# EAGLE design Board (EAGLE 9.2.2)
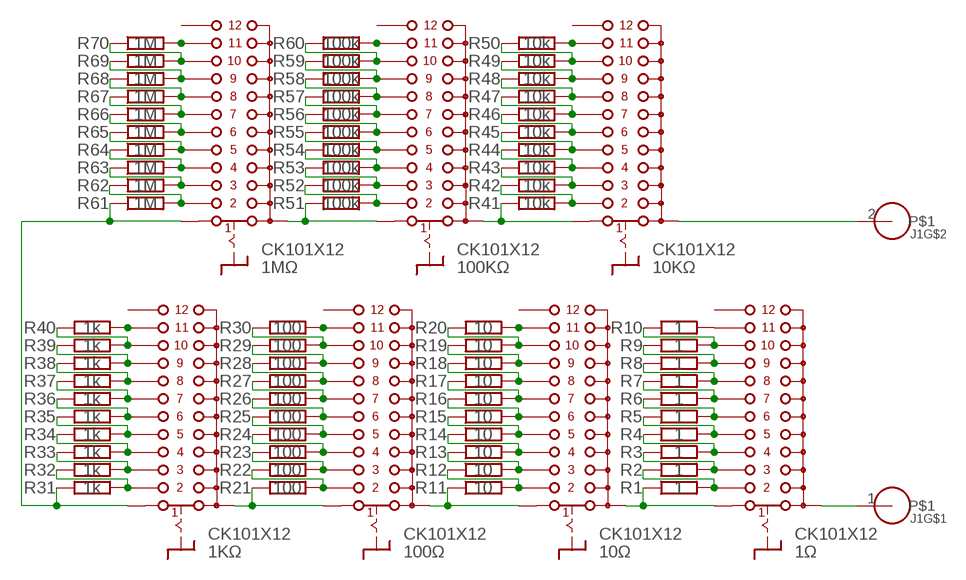
[diagram p0: schematic, sheet 1]

## Parts
1KΩ  CK101X12  [CK101X12]
1MΩ  CK101X12  [CK101X12]
1Ω  CK101X12  [CK101X12]
10KΩ  CK101X12  [CK101X12]
10Ω  CK101X12  [CK101X12]
100KΩ  CK101X12  [CK101X12]
100Ω  CK101X12  [CK101X12]
J1  MOLEX-1X2  [MOLEX-1X2_LOCK]
R1  1  R-EU  [0207/2V]
R2  1  R-EU  [0207/2V]
R3  1  R-EU  [0207/2V]
R4  1  R-EU  [0207/2V]
R5  1  R-EU  [0207/2V]
R6  1  R-EU  [0207/2V]
R7  1  R-EU  [0207/2V]
R8  1  R-EU  [0207/2V]
R9  1  R-EU  [0207/2V]
R10  1  R-EU  [0207/2V]
R11  10  R-EU  [0207/2V]
R12  10  R-EU  [0207/2V]
R13  10  R-EU  [0207/2V]
R14  10  R-EU  [0207/2V]
R15  10  R-EU  [0207/2V]
R16  10  R-EU  [0207/2V]
R17  10  R-EU  [0207/2V]
R18  10  R-EU  [0207/2V]
R19  10  R-EU  [0207/2V]
R20  10  R-EU  [0207/2V]
R21  100  R-EU  [0207/2V]
R22  100  R-EU  [0207/2V]
R23  100  R-EU  [0207/2V]
R24  100  R-EU  [0207/2V]
R25  100  R-EU  [0207/2V]
R26  100  R-EU  [0207/2V]
R27  100  R-EU  [0207/2V]
R28  100  R-EU  [0207/2V]
R29  100  R-EU  [0207/2V]
R30  100  R-EU  [0207/2V]
R31  1k  R-EU  [0207/2V]
R32  1k  R-EU  [0207/2V]
R33  1k  R-EU  [0207/2V]
R34  1k  R-EU  [0207/2V]
R35  1k  R-EU  [0207/2V]
R36  1k  R-EU  [0207/2V]
R37  1k  R-EU  [0207/2V]
R38  1k  R-EU  [0207/2V]
R39  1k  R-EU  [0207/2V]
R40  1k  R-EU  [0207/2V]
R41  10k  R-EU  [0207/2V]
R42  10k  R-EU  [0207/2V]
R43  10k  R-EU  [0207/2V]
R44  10k  R-EU  [0207/2V]
R45  10k  R-EU  [0207/2V]
R46  10k  R-EU  [0207/2V]
R47  10k  R-EU  [0207/2V]
R48  10k  R-EU  [0207/2V]
R49  10k  R-EU  [0207/2V]
R50  10k  R-EU  [0207/2V]
R51  100k  R-EU  [0207/2V]
R52  100k  R-EU  [0207/2V]
R53  100k  R-EU  [0207/2V]
R54  100k  R-EU  [0207/2V]
R55  100k  R-EU  [0207/2V]
R56  100k  R-EU  [0207/2V]
R57  100k  R-EU  [0207/2V]
R58  100k  R-EU  [0207/2V]
R59  100k  R-EU  [0207/2V]
R60  100k  R-EU  [0207/2V]
R61  1M  R-EU  [0207/2V]
R62  1M  R-EU  [0207/2V]
R63  1M  R-EU  [0207/2V]
R64  1M  R-EU  [0207/2V]
R65  1M  R-EU  [0207/2V]
R66  1M  R-EU  [0207/2V]
R67  1M  R-EU  [0207/2V]
R68  1M  R-EU  [0207/2V]
R69  1M  R-EU  [0207/2V]
R70  1M  R-EU  [0207/2V]

## Nets
N$1: 1Ω.2 R1.2 R2.1
N$2: 10Ω.2 R11.2 R12.1
N$3: 10Ω.1 100Ω.A R11.1
N$4: 10Ω.3 R12.2 R13.1
N$5: 10Ω.4 R13.2 R14.1
N$6: 10Ω.5 R14.2 R15.1
N$7: 10Ω.6 R15.2 R16.1
N$8: 10Ω.7 R16.2 R17.1
N$9: 10Ω.8 R17.2 R18.1
N$10: 10Ω.9 R18.2 R19.1
N$11: 1KΩ.10 R39.2 R40.1
N$12: 1Ω.3 R2.2 R3.1
N$13: 1Ω.4 R3.2 R4.1
N$14: 1Ω.5 R4.2 R5.1
N$15: 1Ω.6 R5.2 R6.1
N$16: 10Ω.10 R19.2 R20.1
N$17: 1Ω.7 R6.2 R7.1
N$18: 1Ω.8 R7.2 R8.1
N$19: 1Ω.9 R8.2 R9.1
N$20: 1Ω.10 R9.2 R10.1
N$21: 1Ω.11 R10.2
N$22: 10Ω.11 R20.2
N$23: 100Ω.2 R21.2 R22.1
N$24: 10KΩ.1 100KΩ.A R41.1
N$25: 100Ω.3 R22.2 R23.1
N$26: 100Ω.4 R23.2 R24.1
N$27: 100Ω.5 R24.2 R25.1
N$28: 100Ω.6 R25.2 R26.1
N$29: 100Ω.7 R26.2 R27.1
N$30: 100Ω.8 R27.2 R28.1
N$31: 100Ω.9 R28.2 R29.1
N$32: 100Ω.10 R29.2 R30.1
N$33: 100Ω.11 R30.2
N$34: 1KΩ.2 R31.2 R32.1
N$35: 1Ω.1 10Ω.A R1.1
N$36: 1KΩ.3 R32.2 R33.1
N$37: 1KΩ.4 R33.2 R34.1
N$38: 1KΩ.5 R34.2 R35.1
N$39: 1KΩ.6 R35.2 R36.1
N$40: 1KΩ.7 R36.2 R37.1
N$41: 1KΩ.8 R37.2 R38.1
N$42: 1KΩ.9 R38.2 R39.1
N$43: 1KΩ.1 1MΩ.1 R31.1 R61.1
N$44: 1KΩ.11 R40.2
N$45: 10KΩ.2 R41.2 R42.1
N$46: 10KΩ.A J1.2
N$47: 10KΩ.3 R42.2 R43.1
N$48: 10KΩ.4 R43.2 R44.1
N$49: 10KΩ.5 R44.2 R45.1
N$50: 10KΩ.6 R45.2 R46.1
N$51: 10KΩ.7 R46.2 R47.1
N$52: 10KΩ.8 R47.2 R48.1
N$53: 10KΩ.9 R48.2 R49.1
N$54: 10KΩ.10 R49.2 R50.1
N$55: 10KΩ.11 R50.2
N$56: 100KΩ.2 R51.2 R52.1
N$57: 1MΩ.A 100KΩ.1 R51.1
N$58: 100KΩ.3 R52.2 R53.1
N$59: 100KΩ.4 R53.2 R54.1
N$60: 100KΩ.5 R54.2 R55.1
N$61: 100KΩ.6 R55.2 R56.1
N$62: 100KΩ.7 R56.2 R57.1
N$63: 100KΩ.8 R57.2 R58.1
N$64: 100KΩ.9 R58.2 R59.1
N$65: 100KΩ.10 R59.2 R60.1
N$66: 100KΩ.11 R60.2
N$67: 1MΩ.2 R61.2 R62.1
N$68: 1KΩ.A 100Ω.1 R21.1
N$69: 1MΩ.3 R62.2 R63.1
N$70: 1MΩ.4 R63.2 R64.1
N$71: 1MΩ.5 R64.2 R65.1
N$72: 1MΩ.6 R65.2 R66.1
N$73: 1MΩ.7 R66.2 R67.1
N$74: 1MΩ.8 R67.2 R68.1
N$75: 1MΩ.9 R68.2 R69.1
N$76: 1MΩ.10 R69.2 R70.1
N$77: 1MΩ.11 R70.2
N$81: 1Ω.A J1.1
Unconnected: 1KΩ.12 1MΩ.12 1Ω.12 10KΩ.12 10Ω.12 100KΩ.12 100Ω.12

## Library data of the parts
1KΩ 1MΩ 1Ω 10KΩ 10Ω 100KΩ 100Ω = DecadeResistanceBox:CK101X12
J1 = DecadeResistanceBox:MOLEX-1X2
R1-R70 = DecadeResistanceBox:R-EU

## Board
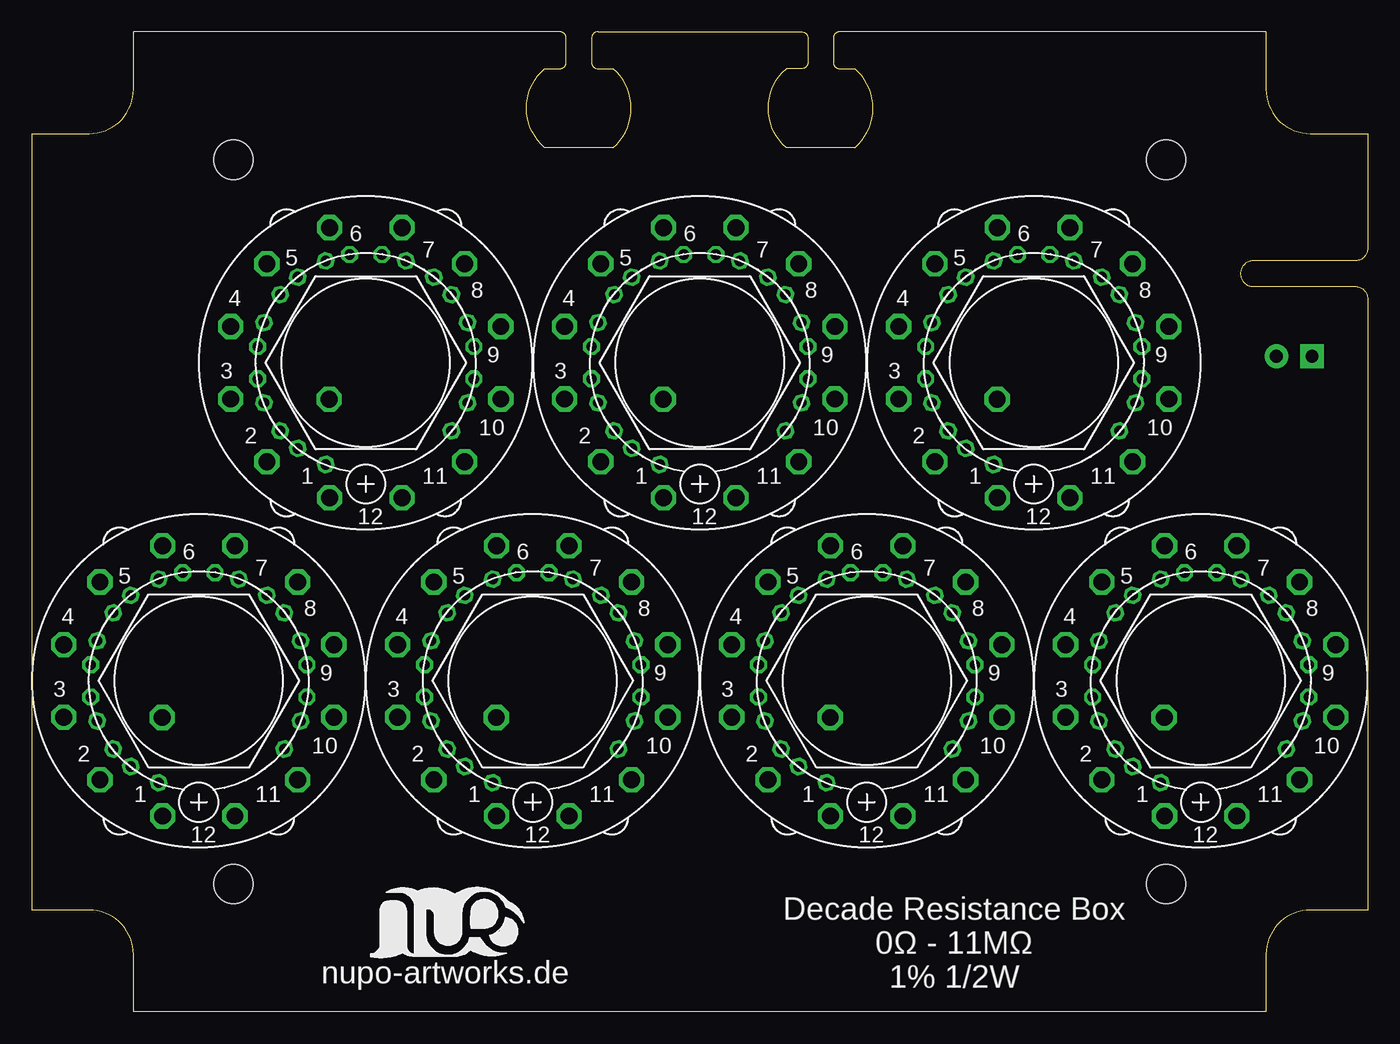
[diagram p1: board, top side]
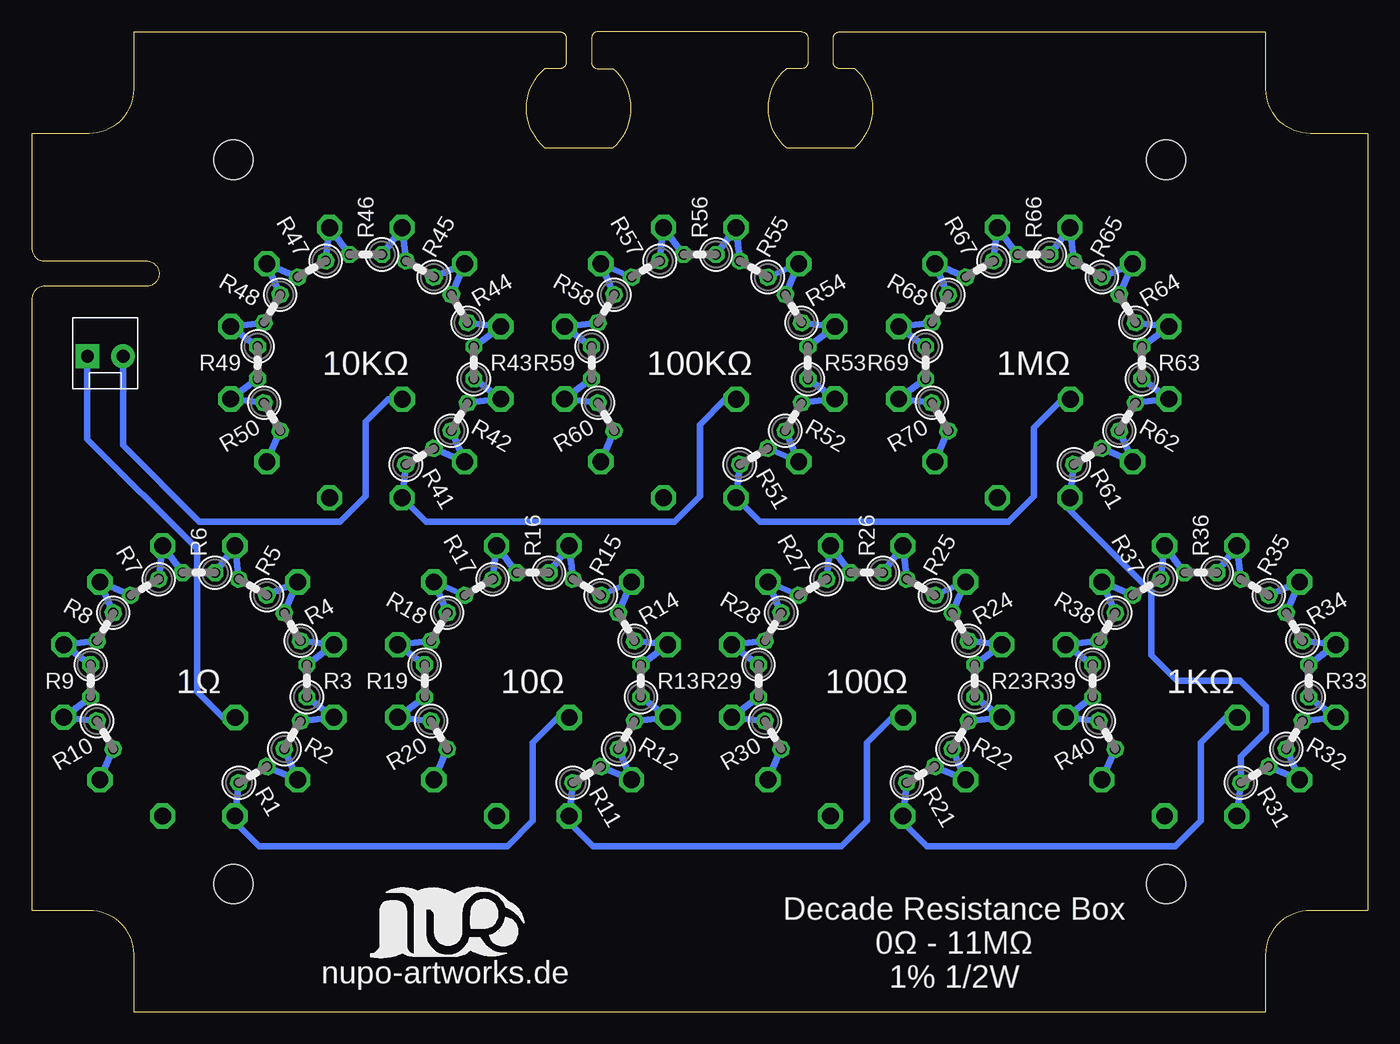
[diagram p2: board, bottom side, seen from below]

Size 105 x 77 mm. Coordinates in mm from the lower left corner, seen from the top.
Outline: 0,69 0,8 4.5,8 arc-90 8,4.5 8,0 97,0 97,4.5 arc-90 100.5,8 105,8 105,56 arc90 104,57 96,57 arc-90 95,58 arc-90 96,59 104,59 arc90 105,60 105,69 100.5,69 arc-90 97,72.5 97,77 63.5,77 arc90 63,76.5 63,74.6 arc90 63.5,74.1 64.7,74.1 arc-98 64.7,67.9 59.3,67.9 arc-98 59.3,74.1 60.5,74.1 arc90 61,74.6 61,76.5 arc90 60.5,77 44.5,77 arc90 44,76.5 44,74.6 arc90 44.5,74.1 45.7,74.1 arc-98 45.7,67.9 40.3,67.9 arc-98 40.3,74.1 41.5,74.1 arc90 42,74.6 42,76.5 arc90 41.5,77 8,77 8,72.5 arc-90 4.5,69 0,69
Copper layers (1*16): Top 0.035mm / dielectric 1.5mm / Bottom 0.035mm
Design rules "default *": minimum track width 0.5mm, minimum drill 0.35mm, track to track 6mil, track to pad 6mil, pad to pad 6mil, via to via 6mil, smd to smd 6mil, copper to edge 40mil, drill to drill 6mil, minimum pad ring 10mil, minimum via ring 8mil, stop-mask expansion 4mil, vias tented up to drill 0mil, thermal gap 10mil
Holes 3.1 mm at 15.85,66.95 89.15,66.95 89.15,10.05 15.85,10.05

### Footprints (pad centres in the part's own frame; a part is rotated, then mirrored left to right if it is on the bottom)
CK101X12 = drill 1.321 octagon: 1 -2.845,-10.617; 2 -7.772,-7.772; 3 -10.617,-2.845; 4 -10.617,2.845; 5 -7.772,7.772; 6 -2.845,10.617; 7 2.845,10.617; 8 7.772,7.772; 9 10.617,2.845; 10 10.617,-2.845; 11 7.772,-7.772; 12 2.845,-10.617; A -2.87,-2.87
MOLEX-1X2_LOCK = drill 1.016 pad 1.88 square: 1 -0.127,0 | drill 1.016 pad 1.88: 2 2.667,0
0207/2V = drill 0.813 octagon: 1 -1.27,0; 2 1.27,0

### Placement (x,y rotation side)
1KΩ  13.12,26 0 top
1MΩ  26.25,51 0 top
1Ω  91.88,26 0 top
10KΩ  78.75,51 0 top
10Ω  65.62,26 0 top
100KΩ  52.5,51 0 top
100Ω  39.38,26 0 top
J1  100.5,51.5 0 bottom
R1  87.62,18.64 30 bottom
R2  84.51,21.75 60 bottom
R3  83.38,26 90 bottom
R4  84.51,30.25 120 bottom
R5  87.62,33.36 150 bottom
R6  91.88,34.5 180 bottom
R7  96.12,33.36 210 bottom
R8  99.24,30.25 240 bottom
R9  100.38,26 270 bottom
R10  99.24,21.75 300 bottom
R11  61.38,18.64 30 bottom
R12  58.26,21.75 60 bottom
R13  57.12,26 90 bottom
R14  58.26,30.25 120 bottom
R15  61.38,33.36 150 bottom
R16  65.62,34.5 180 bottom
R17  69.88,33.36 210 bottom
R18  72.99,30.25 240 bottom
R19  74.12,26 270 bottom
R20  72.99,21.75 300 bottom
R21  35.12,18.64 30 bottom
R22  32.01,21.75 60 bottom
R23  30.88,26 90 bottom
R24  32.01,30.25 120 bottom
R25  35.12,33.36 150 bottom
R26  39.38,34.5 180 bottom
R27  43.62,33.36 210 bottom
R28  46.74,30.25 240 bottom
R29  47.88,26 270 bottom
R30  46.74,21.75 300 bottom
R31  8.88,18.64 30 bottom
R32  5.76,21.75 60 bottom
R33  4.62,26 90 bottom
R34  5.76,30.25 120 bottom
R35  8.88,33.36 150 bottom
R36  13.12,34.5 180 bottom
R37  17.38,33.36 210 bottom
R38  20.49,30.25 240 bottom
R39  21.62,26 270 bottom
R40  20.49,21.75 300 bottom
R41  74.5,43.64 30 bottom
R42  71.39,46.75 60 bottom
R43  70.25,51 90 bottom
R44  71.39,55.25 120 bottom
R45  74.5,58.36 150 bottom
R46  78.75,59.5 180 bottom
R47  83,58.36 210 bottom
R48  86.11,55.25 240 bottom
R49  87.25,51 270 bottom
R50  86.11,46.75 300 bottom
R51  48.25,43.64 30 bottom
R52  45.14,46.75 60 bottom
R53  44,51 90 bottom
R54  45.14,55.25 120 bottom
R55  48.25,58.36 150 bottom
R56  52.5,59.5 180 bottom
R57  56.75,58.36 210 bottom
R58  59.86,55.25 240 bottom
R59  61,51 270 bottom
R60  59.86,46.75 300 bottom
R61  22,43.64 30 bottom
R62  18.89,46.75 60 bottom
R63  17.75,51 90 bottom
R64  18.89,55.25 120 bottom
R65  22,58.36 150 bottom
R66  26.25,59.5 180 bottom
R67  30.5,58.36 210 bottom
R68  33.61,55.25 240 bottom
R69  34.75,51 270 bottom
R70  33.61,46.75 300 bottom
U$1  [LOGO-SILKSCREEN]  32.5,6 0 top
U$2  [LOGO-SILKSCREEN]  72.5,6 0 bottom

### Tracks (layer width: path | path; a pad name or v marks a point on that pad's centre or on a via)
N$1
  Bottom 0.5: R1.2 1Ω.2 R2.1
N$2
  Bottom 0.5: R12.1 10Ω.2 R11.2
N$3
  Bottom 0.5: R11.1 10Ω.1
  Bottom 0.508: 10Ω.1 62.78,14.88 60.9,13 41.38,13 39.38,15 39.38,21.13 37.38,23.13 100Ω.A
N$4
  Bottom 0.5: R13.1 10Ω.3 R12.2
N$5
  Bottom 0.5: R14.1 10Ω.4 R13.2
N$6
  Bottom 0.5: R15.1 10Ω.5 R14.2
N$7
  Bottom 0.5: R16.1 10Ω.6 R15.2
N$8
  Bottom 0.5: R17.1 10Ω.7 R16.2
N$9
  Bottom 0.5: R18.1 10Ω.8 R17.2
N$10
  Bottom 0.5: R19.1 10Ω.9 R18.2
N$11
  Bottom 0.5: R40.1 1KΩ.10 R39.2
N$12
  Bottom 0.5: R2.2 1Ω.3 R3.1
N$13
  Bottom 0.5: R3.2 1Ω.4 R4.1
N$14
  Bottom 0.5: R4.2 1Ω.5 R5.1
N$15
  Bottom 0.5: R5.2 1Ω.6 R6.1
N$16
  Bottom 0.5: R20.1 10Ω.10 R19.2
N$17
  Bottom 0.5: R6.2 1Ω.7 R7.1
N$18
  Bottom 0.5: R7.2 1Ω.8 R8.1
N$19
  Bottom 0.5: R8.2 1Ω.9 R9.1
N$20
  Bottom 0.5: R9.2 1Ω.10 R10.1
N$21
  Bottom 0.5: R10.2 1Ω.11
N$22
  Bottom 0.5: 10Ω.11 R20.2
N$23
  Bottom 0.5: R21.2 100Ω.2 R22.1
N$24
  Bottom 0.5: R41.1 10KΩ.1 74.02,38.5 54.5,38.5 52.5,40.5 52.5,46.13 50.5,48.13 100KΩ.A
N$25
  Bottom 0.5: R22.2 100Ω.3 R23.1
N$26
  Bottom 0.5: R23.2 100Ω.4 R24.1
N$27
  Bottom 0.5: R24.2 100Ω.5 R25.1
N$28
  Bottom 0.5: R25.2 100Ω.6 R26.1
N$29
  Bottom 0.5: R26.2 100Ω.7 R27.1
N$30
  Bottom 0.5: R27.2 100Ω.8 R28.1
N$31
  Bottom 0.5: R28.2 100Ω.9 R29.1
N$32
  Bottom 0.5: R29.2 100Ω.10 R30.1
N$33
  Bottom 0.5: R30.2 100Ω.11
N$34
  Bottom 0.5: R32.1 1KΩ.2 R31.2
N$35
  Bottom 0.5: 1Ω.1 R1.1
  Bottom 0.508: 1Ω.1 89.03,14.88 87.15,13 67.62,13 65.62,15 65.62,21.13 63.62,23.13 10Ω.A
N$36
  Bottom 0.5: R33.1 1KΩ.3 R32.2
N$37
  Bottom 0.5: R34.1 1KΩ.4 R33.2
N$38
  Bottom 0.5: R35.1 1KΩ.5 R34.2
N$39
  Bottom 0.5: R36.1 1KΩ.6 R35.2
N$40
  Bottom 0.5: R37.1 1KΩ.7 R36.2
N$41
  Bottom 0.5: R38.1 1KΩ.8 R37.2
N$42
  Bottom 0.5: R39.1 1KΩ.9 R38.2
N$43
  Bottom 0.5: R61.1 1MΩ.1 23.41,39.41 17,33 17,28 15,26 10,26 8,24 8,22 9.97,20.02 R31.1 1KΩ.1
N$44
  Bottom 0.5: R40.2 1KΩ.11
N$45
  Bottom 0.5: R42.1 10KΩ.2 R41.2
N$46
  Bottom 0.5: 10KΩ.A 77,48.13 78.75,46.38 78.75,40.5 80.75,38.5 91.83,38.5 97.83,44.5 J1.2
N$47
  Bottom 0.5: R43.1 10KΩ.3 R42.2
N$48
  Bottom 0.5: R44.1 10KΩ.4 R43.2
N$49
  Bottom 0.5: R45.1 10KΩ.5 R44.2
N$50
  Bottom 0.5: R46.1 10KΩ.6 R45.2
N$51
  Bottom 0.5: R47.1 10KΩ.7 R46.2
N$52
  Bottom 0.5: R48.1 10KΩ.8 R47.2
N$53
  Bottom 0.5: R49.1 10KΩ.9 R48.2
N$54
  Bottom 0.5: R50.1 10KΩ.10 R49.2
N$55
  Bottom 0.5: R50.2 10KΩ.11
N$56
  Bottom 0.5: R51.2 100KΩ.2 R52.1
N$57
  Bottom 0.5: R51.1 100KΩ.1 47.77,38.5 28.25,38.5 26.25,40.5 26.25,45.88 24,48.13 1MΩ.A
N$58
  Bottom 0.5: R52.2 100KΩ.3 R53.1
N$59
  Bottom 0.5: R53.2 100KΩ.4 R54.1
N$60
  Bottom 0.5: R54.2 100KΩ.5 R55.1
N$61
  Bottom 0.5: R55.2 100KΩ.6 R56.1
N$62
  Bottom 0.5: R56.2 100KΩ.7 R57.1
N$63
  Bottom 0.5: R57.2 100KΩ.8 R58.1
N$64
  Bottom 0.5: R58.2 100KΩ.9 R59.1
N$65
  Bottom 0.5: R59.2 100KΩ.10 R60.1
N$66
  Bottom 0.5: R60.2 100KΩ.11
N$67
  Bottom 0.5: R61.2 1MΩ.2 R62.1
N$68
  Bottom 0.5: 100Ω.1 R21.1
  Bottom 0.508: 100Ω.1 36.53,14.88 34.65,13 15.12,13 13.12,15 13.12,21.13 11.12,23.13 1KΩ.A
N$69
  Bottom 0.5: R62.2 1MΩ.3 R63.1
N$70
  Bottom 0.5: R63.2 1MΩ.4 R64.1
N$71
  Bottom 0.5: R64.2 1MΩ.5 R65.1
N$72
  Bottom 0.5: R65.2 1MΩ.6 R66.1
N$73
  Bottom 0.5: R66.2 1MΩ.7 R67.1
N$74
  Bottom 0.5: R67.2 1MΩ.8 R68.1
N$75
  Bottom 0.5: R68.2 1MΩ.9 R69.1
N$76
  Bottom 0.5: R69.2 1MΩ.10 R70.1
N$77
  Bottom 0.5: R70.2 1MΩ.11
N$81
  Bottom 0.508: 1Ω.A 90,23.13 92,25.13 92,36.37 100.63,45 J1.1

### Text on the board
tNames: Decade Resistance Box / 0Ω - 11MΩ / 1% 1/2W | nupo-artworks.de
bNames: Decade Resistance Box / 0Ω - 11MΩ / 1% 1/2W | nupo-artworks.de
Document: Case: Hammond 1591XXSSBK / https://www.conrad.de/de/hammond-electronics-1591xxssbk-universal-gehaeuse-110-x-82-x-44-abs-schwarz-1-st-485623.html